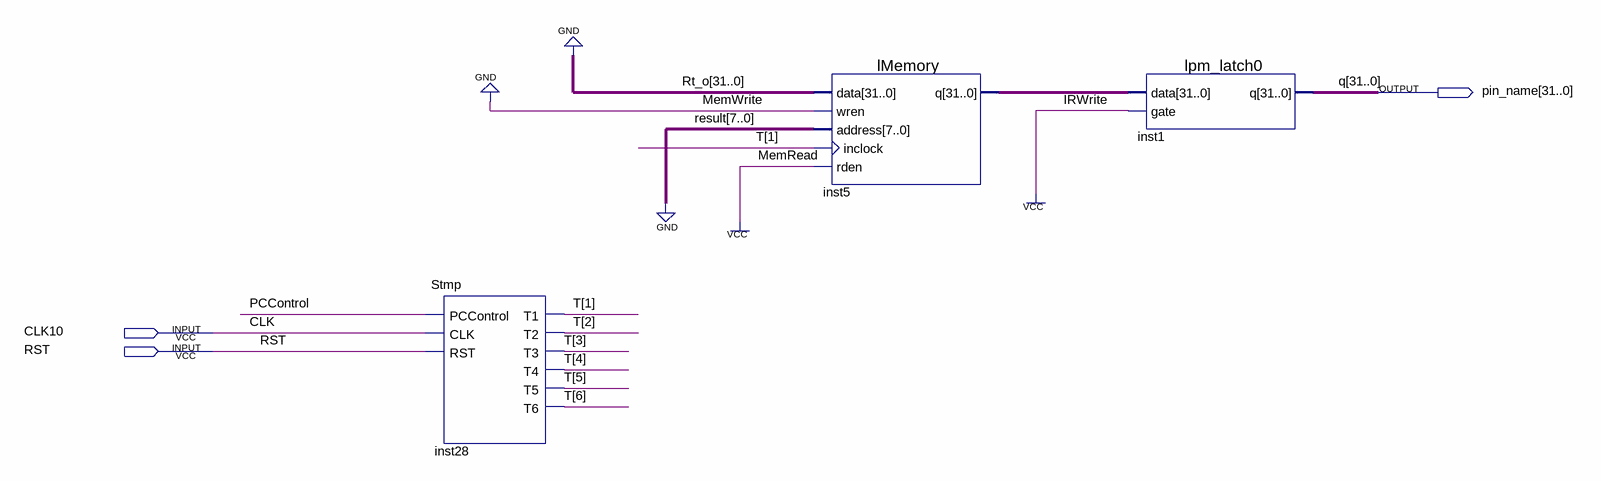
[diagram p0: schematic sheet]
// Quartus schematic ImemoryTes.bdf as structural Verilog: 3 symbols, 3 pins
module ImemoryTes (
  input  CLK10,
  input  RST,
  output [31:0] pin_name
);

  wire PCControl;
  wire [6:1] T;
  wire [31:0] inst5_q;

  Stmp inst28 (
    .PCControl(PCControl), .CLK(CLK10), .RST(RST), .T1(T[1]), .T2(T[2]), .T3(T[3]), .T4(T[4]), .T5(T[5]),
    .T6(T[6]));
  lMemory inst5 (.data({32{1'b0}}), .wren(1'b0), .address({8{1'b0}}), .inclock(T[1]), .rden(1'b1), .q(inst5_q));
  lpm_latch0 inst1 (.data(inst5_q), .gate(1'b1), .q(pin_name));

  // Other names for the same wires on the sheet: CLK = CLK10; q[31:0] = pin_name
endmodule
